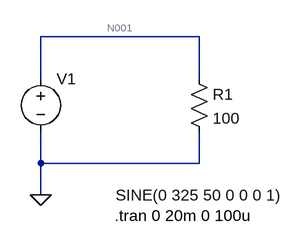
[diagram p0: schematic Draft7.asc]
Draft7.asc, the LTspice schematic file:
Version 4
SHEET 1 880 680
WIRE 400 80 160 80
WIRE 160 144 160 80
WIRE 400 144 400 80
WIRE 160 272 160 224
WIRE 400 272 400 224
WIRE 400 272 160 272
WIRE 160 320 160 272
FLAG 160 320 0
SYMBOL voltage 160 128 R0
WINDOW 3 113 193 Left 2
WINDOW 123 0 0 Left 0
WINDOW 39 0 0 Left 0
SYMATTR InstName V1
SYMATTR Value SINE(0 325 50 0 0 0 1)
SYMBOL res 384 128 R0
SYMATTR InstName R1
SYMATTR Value 100
TEXT 272 352 Left 2 !.tran 0 20m 0 100u

The netlist it stands for:
* Draft7.asc
V1 N001 0 SINE(0 325 50 0 0 0 1)
R1 N001 0 100
.tran 0 20m 0 100u
.backanno
.end

* Results of the author's LTspice run, read from the files saved beside the schematic
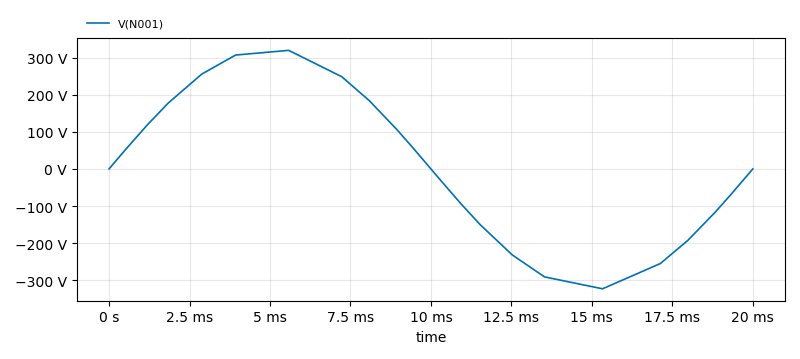
[diagram p1: Transient Analysis of Draft7.asc, plotted from the saved traces]
* Transient Analysis, 1 run:
*   V(N001): min -323 V, max 319.5 V, average 294.1 mV, rms 226.9 V, last 0 V